# EAGLE schematic Mind-Machine-Analog-555 (EAGLE 7.2.0)
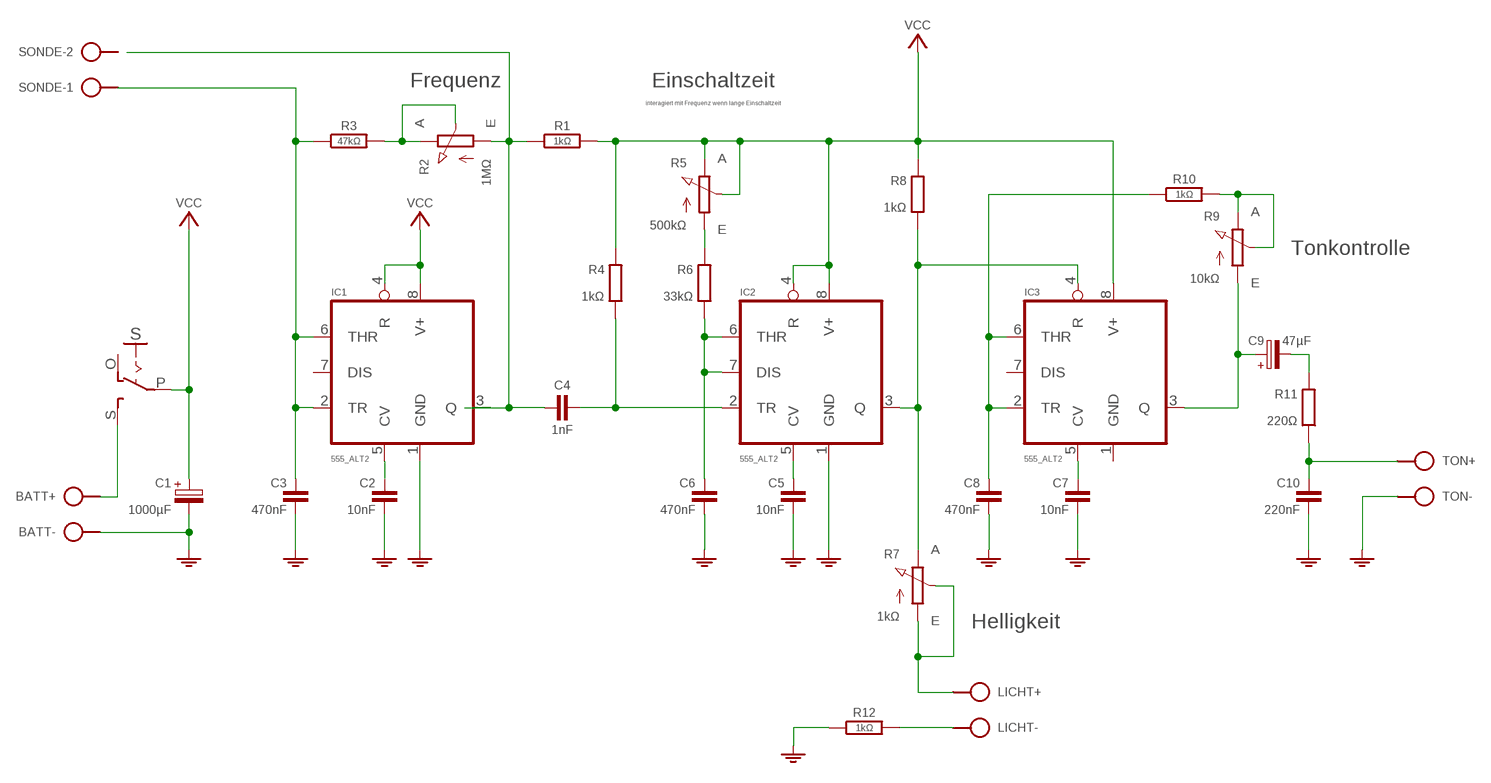
[diagram p0: schematic, sheet 1]

## Parts
BATT  SPAD+-+-  [SPAD+-]
C1  1000µF  CPOLE5-6  [E5-6]
C2  10nF  C025-025X050  [C025-025X050]
C3  470nF  C025-025X050  [C025-025X050]
C4  1nF  C-H050-020X044  [C050-020X044]
C5  10nF  C025-025X050  [C025-025X050]
C6  470nF  C025-025X050  [C025-025X050]
C7  10nF  C025-025X050  [C025-025X050]
C8  470nF  C025-025X050  [C025-025X050]
C9  47µF  CPOL-HE2,5-4  [E2,5-4]
C10  220nF  C025-025X050  [C025-025X050]
IC1  555_ALT2  [DIL08]
IC2  555_ALT2  [DIL08]
IC3  555_ALT2  [DIL08]
LICHT  SPAD+--+  [SPAD-+]
R1  1kΩ  R-H0204/10  [0204/10]
R2  1MΩ  POT  [POT]
R3  47kΩ  R-H0204/10  [0204/10]
R4  1kΩ  R0204/10-V  [0204/10-V]
R5  500kΩ  POT  [POT]
R6  33kΩ  R0204/10-V  [0204/10-V]
R7  1kΩ  POT  [POT]
R8  1kΩ  R0204/10-V  [0204/10-V]
R9  10kΩ  POT  [POT]
R10  1kΩ  R-H0204/10  [0204/10]
R11  220Ω  R0204/10-V  [0204/10-V]
R12  1kΩ  R-H0204/10  [0204/10]
S  SL-SW-1P-2T  [SLSW-1P2T]
SONDE  SPAD-2  [SPAD-2]
TON  SPAD+-+-  [SPAD+-]

## Nets
GND: BATT.1 C1.- C2.2 C3.2 C5.2 C6.2 C7.2 C8.2 C10.2 IC1.1(GND) IC2.1(GND) R12.1 TON.1
N$1: C5.1 IC2.5(CV)
N$2: BATT.2 S.S
N$3: R2.E R2.S R3.2
N$4: C4.1 IC1.3(Q) R1.1 R2.A
N$5: C4.2 IC2.2(TR) R4.2
N$6: C3.1 IC1.2(TR) IC1.6(THR) R3.1 SONDE.1
N$7: C2.1 IC1.5(CV)
N$8: R5.A R6.1
N$9: C6.1 IC2.6(THR) IC2.7(DIS) R6.2
N$10: IC2.3(Q) IC3.4(R) R7.E R8.2
N$11: LICHT.2 R7.A R7.S
N$12: C8.1 IC3.2(TR) IC3.6(THR) R10.1
N$13: R9.E R9.S R10.2
N$14: C9.+ IC3.3(Q) R9.A
N$15: C9.- R11.1
N$16: C10.1 R11.2 TON.2
N$17: C7.1 IC3.5(CV)
N$18: LICHT.1 R12.2
VCC: C1.+ IC1.4(R) IC1.8(V+) IC2.4(R) IC2.8(V+) IC3.8(V+) R1.2 R4.1 R5.E R5.S R8.1 S.P
Unconnected: IC1.7(DIS) IC3.7(DIS) S.O SONDE.2

## Notes on the sheet
- Frequenz | Einschaltzeit
- interagiert mit Frequenz wenn lange Einschaltzeit
- Tonkontrolle
- Helligkeit

## Power pins joined to a net without a drawn wire
GND: IC3.1(GND)

## Library data of the parts
BATT LICHT TON = pad:SPAD+-
C1 = c:CPOL: POLARIZED CAPACITOR, European symbol
C2 C3 C5-C8 C10 = c:C: CAPACITOR, European symbol
C4 = c:C-H
C9 = c:CPOL-H
IC1-IC3 = ic:*555_ALT2
R1 R3 R10 R12 = r:R-H
R2 R5 R7 R9 = r:POT
R4 R6 R8 R11 = r:R: RESISTOR, European symbol
S = sw:SL-SW-1P-2T
SONDE = pad:SPAD-2